# Altium project NUCLEOG431RB-Custom-IN-A2212.PrjPcb (part 3 of 4)

## Sheet Gate_Driver.SchDoc
size A2
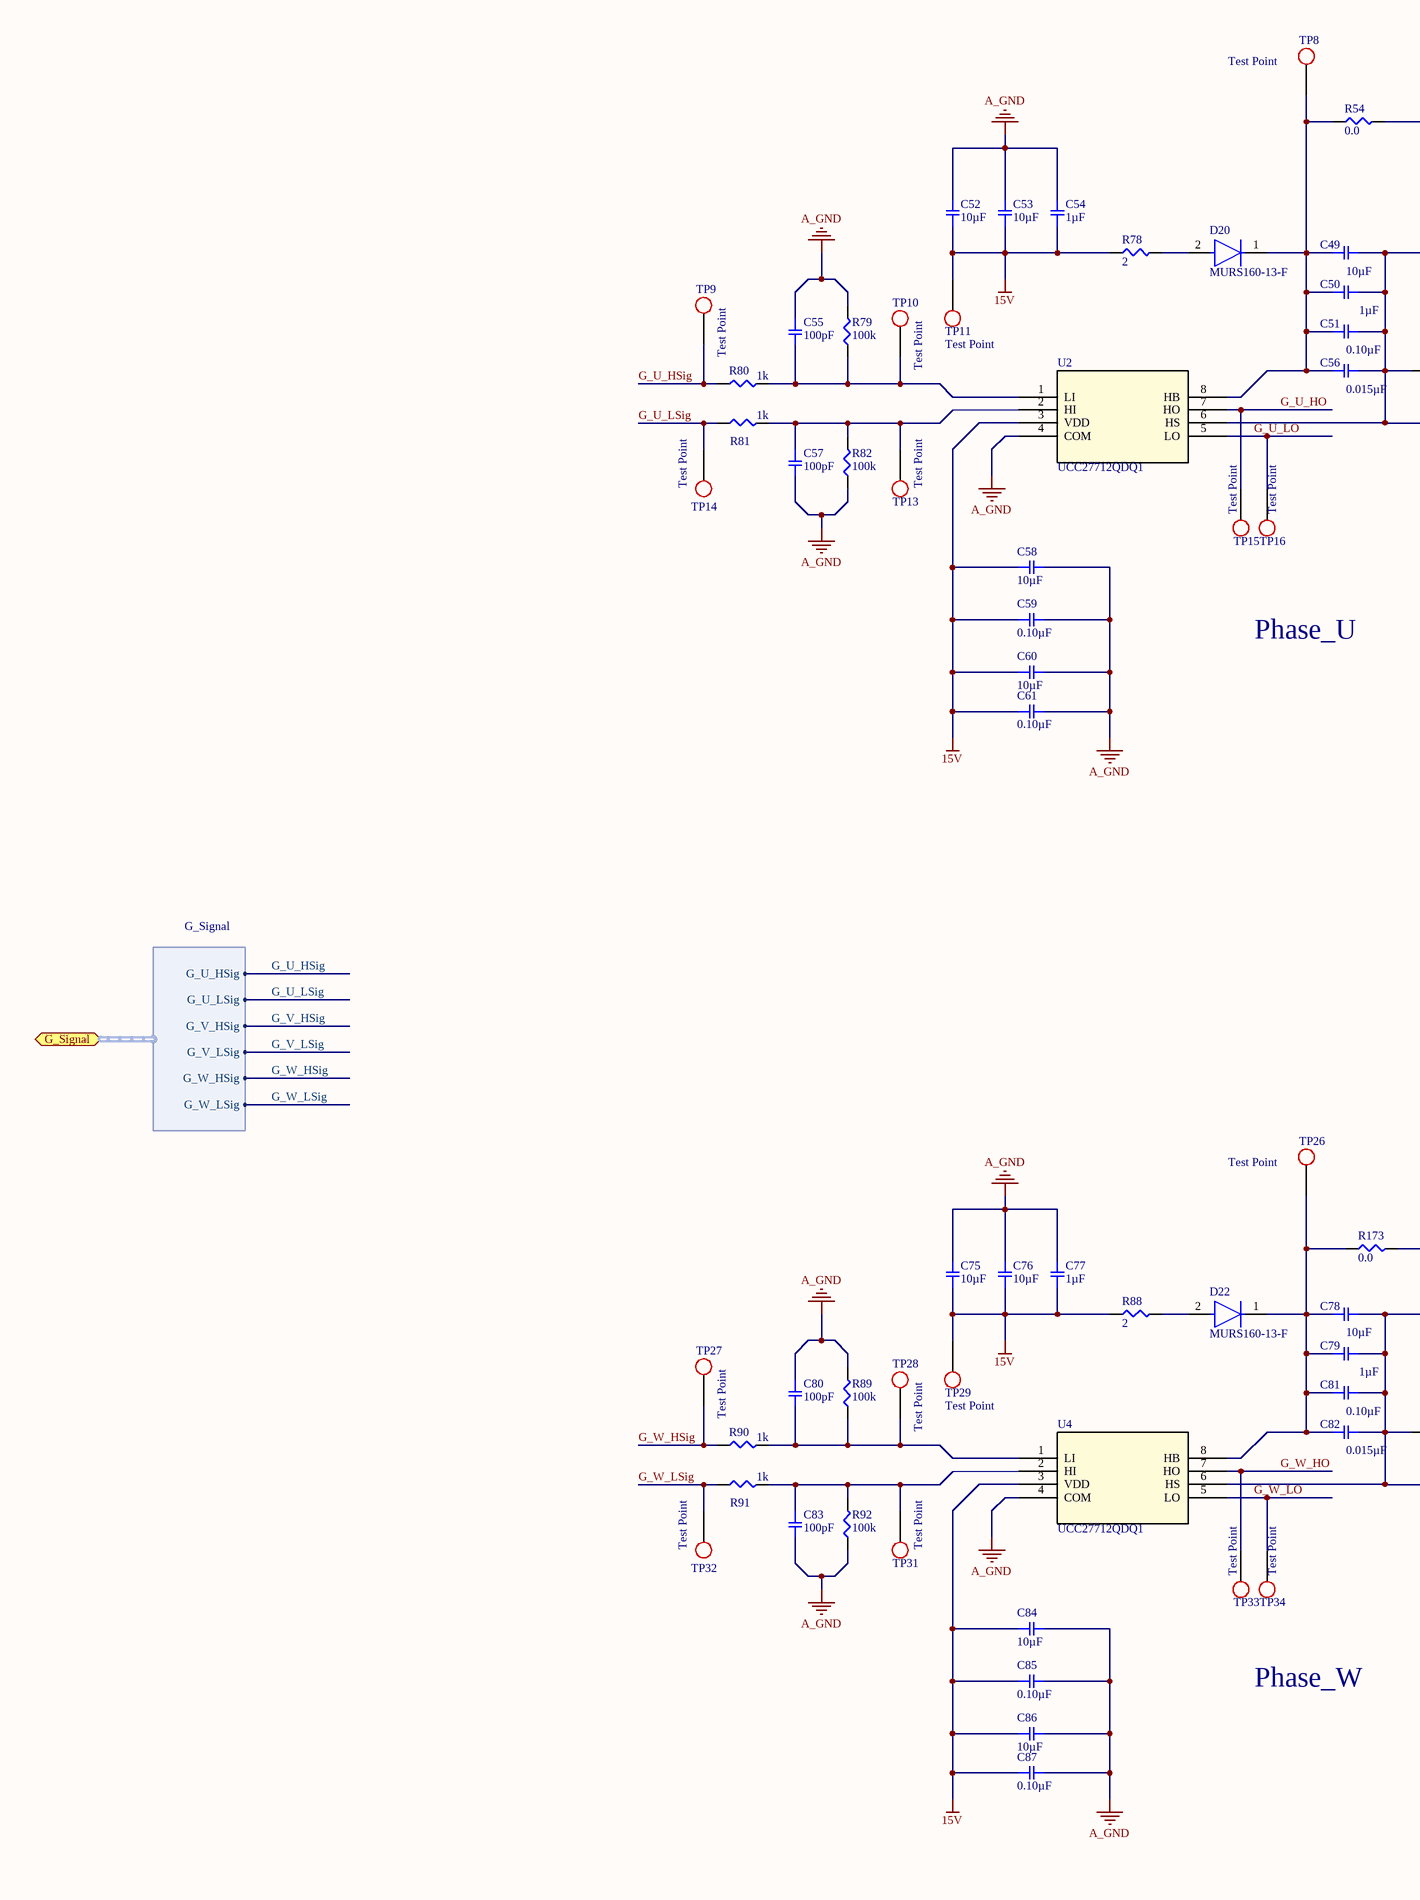
[diagram p5: Gate_Driver.SchDoc, left]
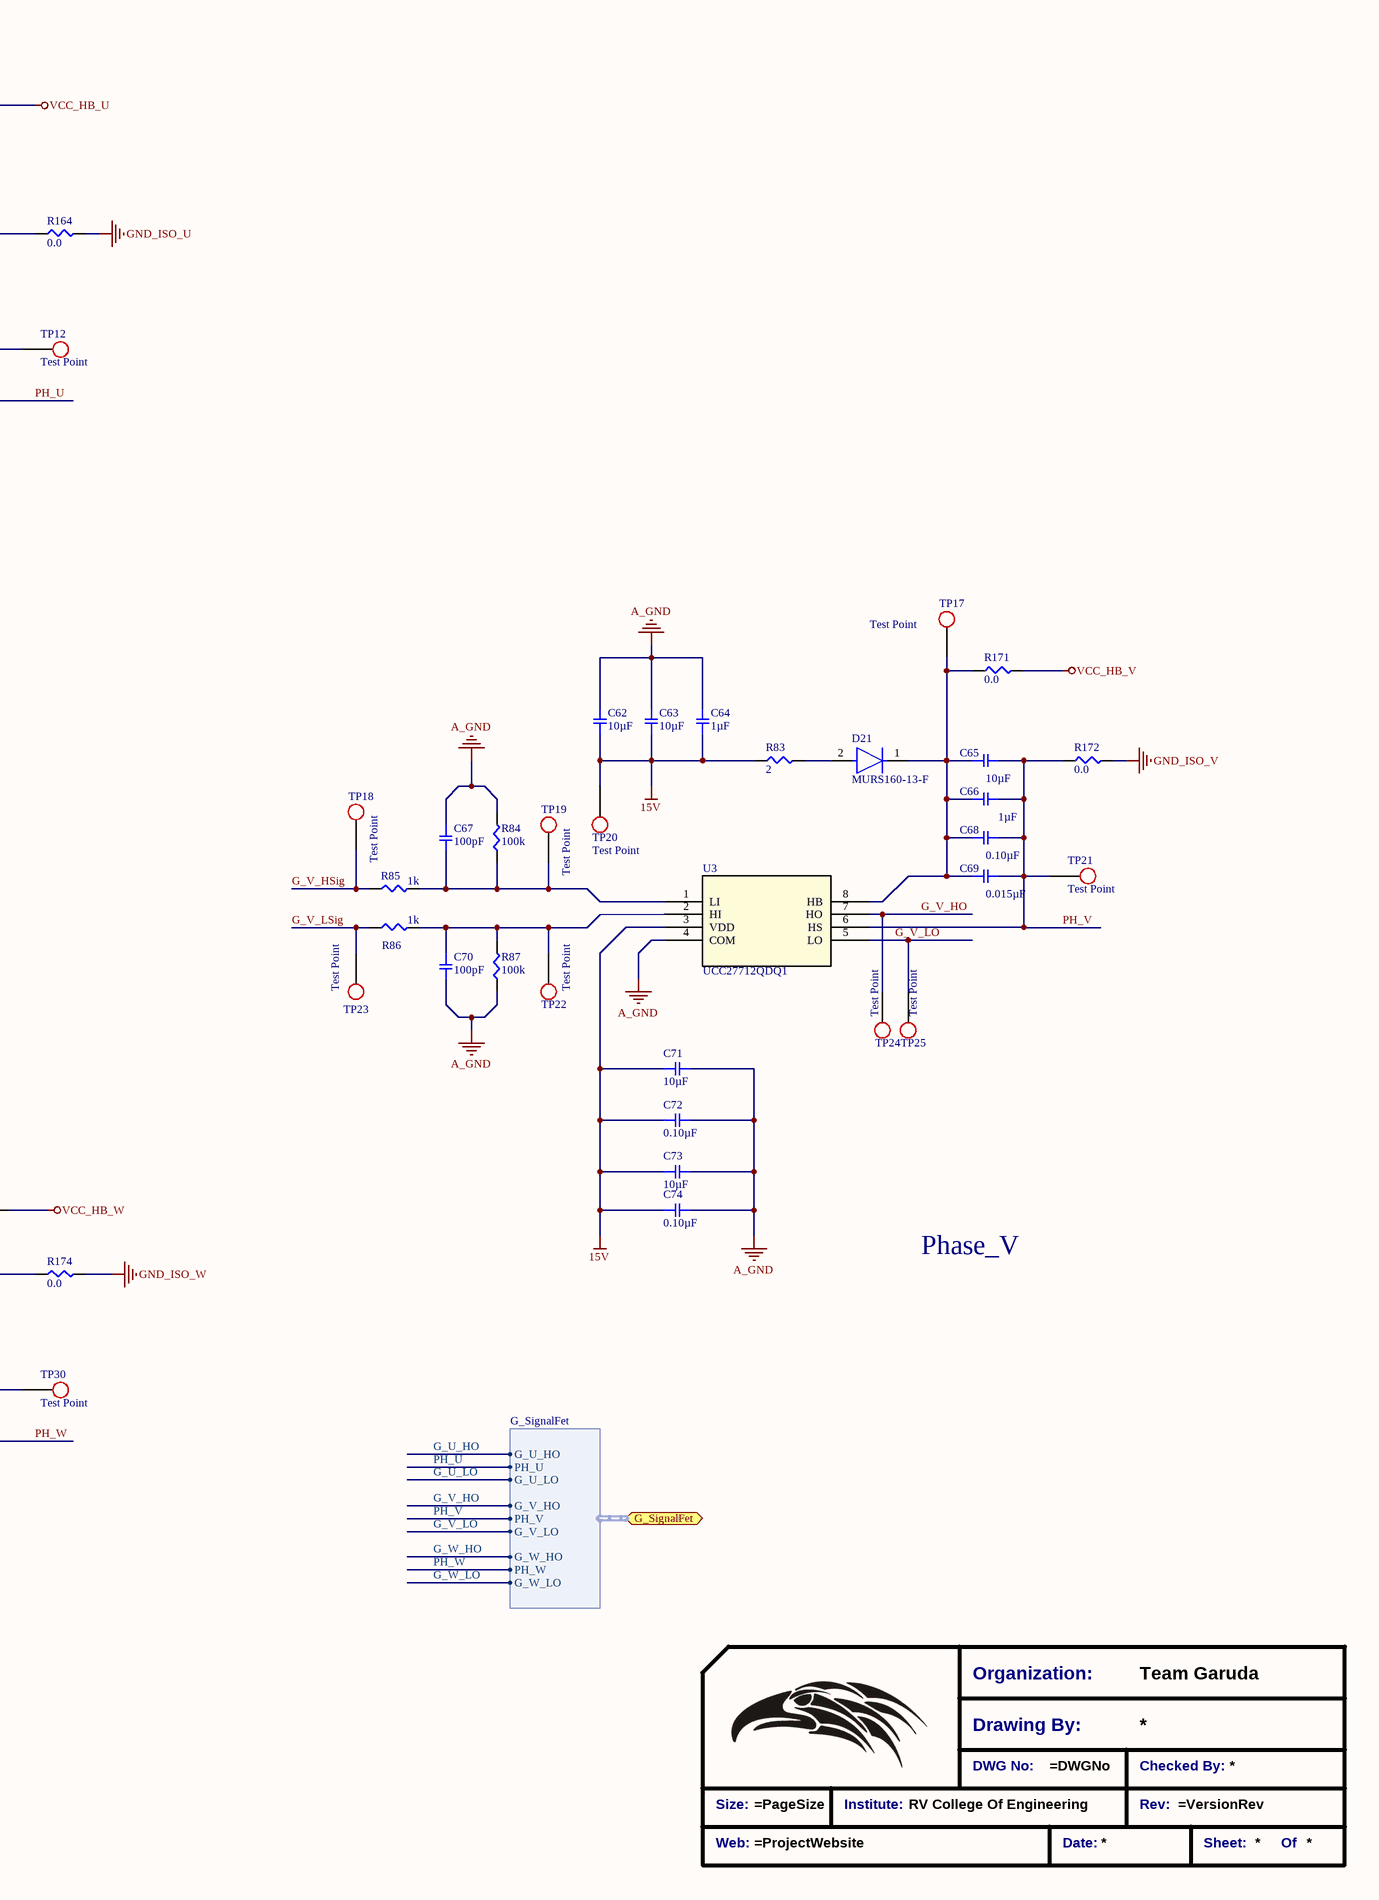
[diagram p6: Gate_Driver.SchDoc, right]

### Parts
(Parts that share a designator on the sheet are numbered #1, #2 ... from top to bottom, then left to right.)
*?#4  Title_Block  (value not drawn)  (graphical)
C49  10µF  [SMD-1206C]
C50  1µF  [SMD-0805C]
C51  0.10µF  [SMD-0805C]
C52  10µF  [SMD-1206C]
C53  10µF  [SMD-1206C]
C54  1µF  [SMD-0805C]
C55  100pF  [SMD-0805C]
C56  0.015µF  [SMD-0603C]
C57  100pF  [SMD-0805C]
C58  10µF  [SMD-1206C]
C59  0.10µF  [SMD-0805C]
C60  10µF  [SMD-1206C]
C61  0.10µF  [SMD-0805C]
C62  10µF  [SMD-1206C]
C63  10µF  [SMD-1206C]
C64  1µF  [SMD-0805C]
C65  10µF  [SMD-1206C]
C66  1µF  [SMD-0805C]
C67  100pF  [SMD-0805C]
C68  0.10µF  [SMD-0805C]
C69  0.015µF  [SMD-0603C]
C70  100pF  [SMD-0805C]
C71  10µF  [SMD-1206C]
C72  0.10µF  [SMD-0805C]
C73  10µF  [SMD-1206C]
C74  0.10µF  [SMD-0805C]
C75  10µF  [SMD-1206C]
C76  10µF  [SMD-1206C]
C77  1µF  [SMD-0805C]
C78  10µF  [SMD-1206C]
C79  1µF  [SMD-0805C]
C80  100pF  [SMD-0805C]
C81  0.10µF  [SMD-0805C]
C82  0.015µF  [SMD-0603C]
C83  100pF  [SMD-0805C]
C84  10µF  [SMD-1206C]
C85  0.10µF  [SMD-0805C]
C86  10µF  [SMD-1206C]
C87  0.10µF  [SMD-0805C]
D20  MURS160-13-F  [FP-SMB-MFG]
D21  MURS160-13-F  [FP-SMB-MFG]
D22  MURS160-13-F  [FP-SMB-MFG]
R54  0.0  [SMD-0805-RES]
R78  2  [SMD-0805-RES]
R79  100k  [SMD-0805-RES]
R80  1k  [SMD-0805-RES]
R81  1k  [SMD-0805-RES]
R82  100k  [SMD-0805-RES]
R83  2  [SMD-0805-RES]
R84  100k  [SMD-0805-RES]
R85  1k  [SMD-0805-RES]
R86  1k  [SMD-0805-RES]
R87  100k  [SMD-0805-RES]
R88  2  [SMD-0805-RES]
R89  100k  [SMD-0805-RES]
R90  1k  [SMD-0805-RES]
R91  1k  [SMD-0805-RES]
R92  100k  [SMD-0805-RES]
R164  0.0  [SMD-0805-RES]
R171  0.0  [SMD-0805-RES]
R172  0.0  [SMD-0805-RES]
R173  0.0  [SMD-0805-RES]
R174  0.0  [SMD-0805-RES]
TP8  Test Point  [Test_point_THT]  (no BOM)
TP9  Test Point  [Test_point_SMD]  (no BOM)
TP10  Test Point  [Test_point_SMD]  (no BOM)
TP11  Test Point  [Test_point_THT]  (no BOM)
TP12  Test Point  [Test_point_THT]  (no BOM)
TP13  Test Point  [Test_point_SMD]  (no BOM)
TP14  Test Point  [Test_point_SMD]  (no BOM)
TP15  Test Point  [Test_point_SMD]  (no BOM)
TP16  Test Point  [Test_point_SMD]  (no BOM)
TP17  Test Point  [Test_point_THT]  (no BOM)
TP18  Test Point  [Test_point_SMD]  (no BOM)
TP19  Test Point  [Test_point_SMD]  (no BOM)
TP20  Test Point  [Test_point_THT]  (no BOM)
TP21  Test Point  [Test_point_THT]  (no BOM)
TP22  Test Point  [Test_point_SMD]  (no BOM)
TP23  Test Point  [Test_point_SMD]  (no BOM)
TP24  Test Point  [Test_point_SMD]  (no BOM)
TP25  Test Point  [Test_point_SMD]  (no BOM)
TP26  Test Point  [Test_point_THT]  (no BOM)
TP27  Test Point  [Test_point_SMD]  (no BOM)
TP28  Test Point  [Test_point_SMD]  (no BOM)
TP29  Test Point  [Test_point_THT]  (no BOM)
TP30  Test Point  [Test_point_THT]  (no BOM)
TP31  Test Point  [Test_point_SMD]  (no BOM)
TP32  Test Point  [Test_point_SMD]  (no BOM)
TP33  Test Point  [Test_point_SMD]  (no BOM)
TP34  Test Point  [Test_point_SMD]  (no BOM)
U2  UCC27712QDQ1  [SOIC127P570X175_HS-9N]
U3  UCC27712QDQ1  [SOIC127P570X175_HS-9N]
U4  UCC27712QDQ1  [SOIC127P570X175_HS-9N]

### Ports
G_Signal (bidir, harness G_Signal), G_SignalFet (bidir, harness G_SignalFet)

### Harnesses
G_Signal: G_U_HSig, G_U_LSig, G_V_HSig, G_V_LSig, G_W_HSig, G_W_LSig
G_SignalFet: G_V_HO, PH_V, G_V_LO, PH_W, G_U_HO, PH_U, G_U_LO, G_W_HO, G_W_LO

### Nets
15V: C52.1 C53.1 C54.1 C58.1 C59.1 C60.1 C61.1 C62.1 C63.1 C64.1 C71.1 C72.1 C73.1 C74.1 C75.1 C76.1 C77.1 C84.1 C85.1 C86.1 C87.1 R78.1 R83.1 R88.1 TP11.1 TP20.1 TP29.1 U2.3(VDD) U3.3(VDD) U4.3(VDD)
A_GND: C52.2 C53.2 C54.2 C55.1 C57.2 C58.2 C59.2 C60.2 C61.2 C62.2 C63.2 C64.2 C67.1 C70.2 C71.2 C72.2 C73.2 C74.2 C75.2 C76.2 C77.2 C80.1 C83.2 C84.2 C85.2 C86.2 C87.2 R79.2 R82.1 R84.2 R87.1 R89.2 R92.1 U2.4(COM) U3.4(COM) U4.4(COM)
GND_ISO_U: R164.2
GND_ISO_V: R172.2
GND_ISO_W: R174.2
VCC_HB_U: R54.2
VCC_HB_V: R171.2
VCC_HB_W: R173.2
G_U_HO: TP15.1 U2.7(HO) ; port G_SignalFet.G_U_HO
G_U_HSig: R80.1 TP9.1 ; port G_Signal.G_U_HSig
G_U_LO: TP16.1 U2.5(LO) ; port G_SignalFet.G_U_LO
G_U_LSig: R81.1 TP14.1 ; port G_Signal.G_U_LSig
G_V_HO: TP24.1 U3.7(HO) ; port G_SignalFet.G_V_HO
G_V_HSig: R85.1 TP18.1 ; port G_Signal.G_V_HSig
G_V_LO: TP25.1 U3.5(LO) ; port G_SignalFet.G_V_LO
G_V_LSig: R86.1 TP23.1 ; port G_Signal.G_V_LSig
G_W_HO: TP33.1 U4.7(HO) ; port G_SignalFet.G_W_HO
G_W_HSig: R90.1 TP27.1 ; port G_Signal.G_W_HSig
G_W_LO: TP34.1 U4.5(LO) ; port G_SignalFet.G_W_LO
G_W_LSig: R91.1 TP32.1 ; port G_Signal.G_W_LSig
PH_U: C49.2 C50.2 C51.2 C56.2 R164.1 TP12.1 U2.6(HS) ; port G_SignalFet.PH_U
PH_V: C65.2 C66.2 C68.2 C69.2 R172.1 TP21.1 U3.6(HS) ; port G_SignalFet.PH_V
PH_W: C78.2 C79.2 C81.2 C82.2 R174.1 TP30.1 U4.6(HS) ; port G_SignalFet.PH_W
NetC49_1: C49.1 C50.1 C51.1 C56.1 D20.1(C) R54.1 TP8.1 U2.8(HB)
NetC55_2: C55.2 R79.1 R80.2 TP10.1 U2.1(LI)
NetC57_1: C57.1 R81.2 R82.2 TP13.1 U2.2(HI)
NetC65_1: C65.1 C66.1 C68.1 C69.1 D21.1(C) R171.1 TP17.1 U3.8(HB)
NetC67_2: C67.2 R84.1 R85.2 TP19.1 U3.1(LI)
NetC70_1: C70.1 R86.2 R87.2 TP22.1 U3.2(HI)
NetC78_1: C78.1 C79.1 C81.1 C82.1 D22.1(C) R173.1 TP26.1 U4.8(HB)
NetC80_2: C80.2 R89.1 R90.2 TP28.1 U4.1(LI)
NetC83_1: C83.1 R91.2 R92.2 TP31.1 U4.2(HI)
NetD20_2: D20.2(A) R78.2
NetD21_2: D21.2(A) R83.2
NetD22_2: D22.2(A) R88.2

### Notes on the sheet
- Phase_U
- Phase_V
- Phase_W
- (in symbol Title_Block) Organization:; Team Garuda; Drawing By:; DWG No:; Checked By:; Size:; Institute:; RV College Of Engineering; Rev:; Web:; Date:; Sheet:; Of

### Library data of the parts
*?#4 = Title_Block: Standard Title Block
C49 C65 C78 = GRJ31CR71E106KE11L: CAP CER 10UF 25V X7R 1206; Manufacturer: Murata Electronics North America; Factory Stock: 0; Unit Price (USD): 0.69; Minimum Quantity: 1; Tolerance: ±10%; Datasheets: http://www.murata.com/~/media/webrenewal/support/library/catalog/products/capacitor/mlcc/c02e.pdf; Image: //media.digikey.com/Renders/Murata%20Renders/GR331BD72E473KW01L.jpg; Digi-Key Part Number: 490-10940-1-ND; Part Number: GRJ31CR71E106KE11L; Quantity Available: 1598; @ qty: 0; Packaging: Cut Tape (CT); Series: GRJ; Part Status: Active; Value: 10µF; Voltage: 25V; Temperature Coefficient: X7R; Operating Temperature: -55°C ~ 125°C; Features: Soft Termination; Ratings: -; Applications: Boardflex Sensitive; Mounting Type: Surface Mount, MLCC; Package / Case: 1206 (3216 Metric); Size / Dimension: 0.126" L x 0.063" W (3.20mm x 1.60mm); Height - Seated (Max): -; Thickness (Max): 0.075" (1.90mm); Lead Spacing: -; Lead Style: -
C50 C66 C79 = GCJ21BR71H105KA01L: CAP CER 1UF 50V X7R 0805; Manufacturer: Murata Electronics North America; Factory Stock: 0; Unit Price (USD): 0.33; Minimum Quantity: 1; Tolerance: ±10%; Datasheets: http://www.murata.com/~/media/webrenewal/support/library/catalog/products/capacitor/mlcc/c03e.ashx; Image: //media.digikey.com/Renders/Murata%20Renders/0805%20(2012%20Metric)%20.85mm.jpg; Digi-Key Part Number: 490-10667-1-ND; Part Number: GCJ21BR71H105KA01L; Quantity Available: 55137; @ qty: 0; Packaging: Cut Tape (CT); Series: GCJ; Part Status: Active; Value: 1µF; Voltage: 50V; Temperature Coefficient: X7R; Operating Temperature: -55°C ~ 125°C; Features: Soft Termination; Ratings: AEC-Q200; Applications: Automotive, Boardflex Sensitive; Mounting Type: Surface Mount, MLCC; Package / Case: 0805 (2012 Metric); Size / Dimension: 0.079" L x 0.049" W (2.00mm x 1.25mm); Height - Seated (Max): -; Thickness (Max): 0.057" (1.45mm); Lead Spacing: -; Lead Style: -
C51 C68 C81 = GRJ21BR71H104KE01L: CAP CER 0.1UF 50V X7R 0805; Manufacturer: Murata Electronics North America; Factory Stock: 0; Unit Price (USD): 0.19; Minimum Quantity: 1; Tolerance: ±10%; Datasheets: http://www.murata.com/~/media/webrenewal/support/library/catalog/products/capacitor/mlcc/c02e.pdf; Image: //media.digikey.com/Renders/Murata%20Renders/0805%20(2012%20Metric)%20.85mm.jpg; Digi-Key Part Number: 490-10923-1-ND; Part Number: GRJ21BR71H104KE01L; Quantity Available: 3070; @ qty: 0; Packaging: Cut Tape (CT); Series: GRJ; Part Status: Active; Value: 0.10µF; Voltage: 50V; Temperature Coefficient: X7R; Operating Temperature: -55°C ~ 125°C; Features: Soft Termination; Ratings: -; Applications: Boardflex Sensitive; Mounting Type: Surface Mount, MLCC; Package / Case: 0805 (2012 Metric); Size / Dimension: 0.079" L x 0.049" W (2.00mm x 1.25mm); Height - Seated (Max): -; Thickness (Max): 0.057" (1.45mm); Lead Spacing: -; Lead Style: -
C52 C53 C58 C60 C62 C63 C71 C73 C75 C76 C84 C86 = GRM31CR61H106KA12L: CAP CER 10UF 50V X5R 1206; Manufacturer: Murata Electronics North America; Factory Stock: 0; Unit Price (USD): 0.65; Minimum Quantity: 1; Tolerance: ±10%; Datasheets: http://www.murata.com/~/media/webrenewal/support/library/catalog/products/capacitor/mlcc/c02e.pdf; Image: //media.digikey.com/Renders/Murata%20Renders/GR331BD72E473KW01L.jpg; Digi-Key Part Number: 490-5961-1-ND; Part Number: GRM31CR61H106KA12L; Quantity Available: 86736; @ qty: 0; Packaging: Cut Tape (CT); Series: GRM; Part Status: Active; Value: 10µF; Voltage: 50V; Temperature Coefficient: X5R; Operating Temperature: -55°C ~ 85°C; Features: -; Ratings: -; Applications: General Purpose; Mounting Type: Surface Mount, MLCC; Package / Case: 1206 (3216 Metric); Size / Dimension: 0.126" L x 0.063" W (3.20mm x 1.60mm); Height - Seated (Max): -; Thickness (Max): 0.071" (1.80mm); Lead Spacing: -; Lead Style: -
C54 C64 C77 = GCJ219R71C105KA01D: CAP CER 1UF 16V X7R 0805; Manufacturer: Murata Electronics North America; Factory Stock: 0; Unit Price (USD): 0.29; Minimum Quantity: 1; Tolerance: ±10%; Datasheets: http://www.murata.com/~/media/webrenewal/support/library/catalog/products/capacitor/mlcc/c03e.ashx; Image: //media.digikey.com/Renders/Murata%20Renders/0805%20(2012%20Metric)%20.85mm.jpg; Digi-Key Part Number: 490-5800-1-ND; Part Number: GCJ219R71C105KA01D; Quantity Available: 140338; @ qty: 0; Packaging: Cut Tape (CT); Series: GCJ; Part Status: Active; Value: 1µF; Voltage: 16V; Temperature Coefficient: X7R; Operating Temperature: -55°C ~ 125°C; Features: Soft Termination; Ratings: AEC-Q200; Applications: Automotive, Boardflex Sensitive; Mounting Type: Surface Mount, MLCC; Package / Case: 0805 (2012 Metric); Size / Dimension: 0.079" L x 0.049" W (2.00mm x 1.25mm); Height - Seated (Max): -; Thickness (Max): 0.037" (0.95mm); Lead Spacing: -; Lead Style: -
C55 C57 C67 C70 C80 C83 = GCM2165C1H101JA16D: CAP CER 100PF 50V NP0 0805; Manufacturer: Murata Electronics North America; Factory Stock: 0; Unit Price (USD): 0.13; Minimum Quantity: 1; Tolerance: ±5%; Temperature Coefficient: C0G, NP0; Datasheets: http://www.murata.com/~/media/webrenewal/support/library/catalog/products/capacitor/mlcc/c03e.ashx; Image: //media.digikey.com/Renders/Murata%20Renders/0805%28GxM6%29.jpg; Digi-Key Part Number: 490-8031-1-ND; Part Number: GCM2165C1H101JA16D; Quantity Available: 42017; @ qty: 0; Packaging: Cut Tape (CT); Series: GCM; Part Status: Active; Value: 100pF; Voltage: 50V; Operating Temperature: -55°C ~ 125°C; Features: -; Ratings: AEC-Q200; Applications: Automotive; Mounting Type: Surface Mount, MLCC; Package / Case: 0805 (2012 Metric); Size / Dimension: 0.079" L x 0.049" W (2.00mm x 1.25mm); Height - Seated (Max): -; Thickness (Max): 0.028" (0.70mm); Lead Spacing: -; Lead Style: -
C56 C69 C82 = GCJ188R72A153KA01D: CAP CER 0.015UF 100V X7R 0603; Manufacturer: Murata Electronics North America; Factory Stock: 0; Unit Price (USD): 0.26; Minimum Quantity: 1; Tolerance: ±10%; Datasheets: http://www.murata.com/~/media/webrenewal/support/library/catalog/products/capacitor/mlcc/c03e.ashx; Image: //media.digikey.com/Renders/Murata%20Renders/0603%28LQG18%29.jpg; Digi-Key Part Number: 490-5770-1-ND; Part Number: GCJ188R72A153KA01D; Quantity Available: 450; @ qty: 0; Packaging: Cut Tape (CT); Series: GCJ; Part Status: Active; Value: 0.015µF; Voltage: 100V; Temperature Coefficient: X7R; Operating Temperature: -55°C ~ 125°C; Features: Soft Termination; Ratings: AEC-Q200; Applications: Automotive, Boardflex Sensitive; Mounting Type: Surface Mount, MLCC; Package / Case: 0603 (1608 Metric); Size / Dimension: 0.063" L x 0.031" W (1.60mm x 0.80mm); Height - Seated (Max): -; Thickness (Max): 0.031" (0.80mm); Lead Spacing: -; Lead Style: -
C59 C61 C72 C74 C85 C87 = GCM21BR71H104KA37K: CAP CER 0.1UF 50V X7R 0805; Manufacturer: Murata Electronics North America; Factory Stock: 0; Unit Price (USD): 0.12; Minimum Quantity: 1; Tolerance: ±10%; Datasheets: http://www.murata.com/~/media/webrenewal/support/library/catalog/products/capacitor/mlcc/c03e.ashx; Image: //media.digikey.com/photos/Murata%20Photos/NCP,GCM%20SERIES%200805.jpg; Digi-Key Part Number: 490-8049-1-ND; Part Number: GCM21BR71H104KA37K; Quantity Available: 322; @ qty: 0; Packaging: Cut Tape (CT); Series: GCM; Part Status: Active; Value: 0.10µF; Voltage: 50V; Temperature Coefficient: X7R; Operating Temperature: -55°C ~ 125°C; Features: -; Ratings: AEC-Q200; Applications: Automotive; Mounting Type: Surface Mount, MLCC; Package / Case: 0805 (2012 Metric); Size / Dimension: 0.079" L x 0.049" W (2.00mm x 1.25mm); Height - Seated (Max): -; Thickness (Max): 0.055" (1.40mm); Lead Spacing: -; Lead Style: -
D20-D22 = CMP-12791-000032-1: DIODE GEN PURP 600V 1A SMB; Manufacturer: Diodes Inc.; Standoff Height: 0.05mm; Max Surge Forward Current: 35A; Capacitance: 10pF; Peak Reverse Current: 5uA; Max Junction Temp: +150°C; Value: 10pF; Reverse Voltage: 600V; Device Class L1: Discrete Semiconductors; Lead Free: Yes; Temperature Range Low: -55°C; Mouser Description: Rectifier Super-Fast Recovery Gpp Smb 1.0A 600V Rohs 3K Rohs Compliant: Yes; Temperature: -55°C to +150°C; Category: Diode; Digikey Description: DIODE GEN PURP 600V 1A SMB; Height: 2.5mm; Manufacturer Part Number: MURS160-13-F; RoHS: TRUE; ComponentLink2Description: Datasheet; Octopart: https://octopart.com/murs160-13-f-diodes+inc.-332437; ComponentLink2URL: https://www.diodes.com/assets/Datasheets/ds30130.pdf; Automotive: No; Max Repetitive Reverse Voltage: 600V; Footprint Url: https://www.diodes.com/assets/Package-Files/SMB.pdf; Device Class L3: Rectifier Diodes; Temperature Range High: +150°C; Device Class L2: Diodes; Package: SMB; Forward Current: 1A
R54 R164 R171-R174 = ERJ-6GEY0R00V: RES SMD 0.0 OHM JUMPER 1/8W 0805; Manufacturer: Panasonic Electronic Components; Factory Stock: 0; Unit Price (USD): 0.00544; @ qty: 1500; Minimum Quantity: 1; Power (Watts): 0.125W, 1/8W; Part Number: ERJ-6GEY0R00V; Datasheets: http://industrial.panasonic.com/www-cgi/jvcr13pz.cgi?E+PZ+3+AOA0001+ERJ6GEY0R00V+7+WW; Image: //media.digikey.com/Renders/Panasonic%20Renders/ERJ-0805%20Pkg.jpg; Digi-Key Part Number: P0.0ACT-ND; Quantity Available: 1597627; Packaging: Cut Tape (CT); Series: ERJ; Part Status: Active; Value: 0.0; Tolerance: Jumper; Composition: Thick Film; Features: Automotive AEC-Q200; Temperature Coefficient: -; Operating Temperature: -55°C ~ 155°C; Package / Case: 0805 (2012 Metric); Supplier Device Package: 0805; Size / Dimension: 0.079" L x 0.049" W (2.00mm x 1.25mm); Height - Seated (Max): 0.028" (0.70mm); Number of Terminations: 2; Failure Rate: -
R78 R83 R88 = ERJ-6BQF2R0V: RES SMD 2 OHM 1% 1/3W 0805; Manufacturer: Panasonic Electronic Components; Factory Stock: 0; Unit Price (USD): 0.05834; @ qty: 1500; Minimum Quantity: 1; Power (Watts): 0.333W, 1/3W; Temperature Coefficient: ±200ppm/°C; Part Number: ERJ-6BQF2R0V; Datasheets: https://industrial.panasonic.com/cdbs/www-data/pdf/RDA0000/AOA0000C239.pdf; Image: //media.digikey.com/Renders/Panasonic%20Renders/ERJ-0805%20Pkg.jpg; Digi-Key Part Number: P17503CT-ND; Quantity Available: 4729; Packaging: Cut Tape (CT); Series: ERJ; Part Status: Active; Value: 2; Tolerance: ±1%; Composition: Thick Film; Features: Automotive AEC-Q200, Current Sense; Operating Temperature: -55°C ~ 125°C; Package / Case: 0805 (2012 Metric); Supplier Device Package: 0805; Size / Dimension: 0.079" L x 0.049" W (2.00mm x 1.25mm); Height - Seated (Max): 0.028" (0.70mm); Number of Terminations: 2; Failure Rate: -
R79 R82 R84 R87 R89 R92 = ERJ-6ENF1003V: RES SMD 100K OHM 1% 1/8W 0805; Manufacturer: Panasonic Electronic Components; Factory Stock: 0; Unit Price (USD): 0.00729; @ qty: 1500; Minimum Quantity: 1; Power (Watts): 0.125W, 1/8W; Temperature Coefficient: ±100ppm/°C; Part Number: ERJ-6ENF1003V; Datasheets: http://industrial.panasonic.com/www-cgi/jvcr13pz.cgi?E+PZ+3+AOA0002+ERJ6ENF1003V+7+WW; Image: //media.digikey.com/Renders/Panasonic%20Renders/ERJ-0805%20Pkg.jpg; Digi-Key Part Number: P100KCCT-ND; Quantity Available: 760677; Packaging: Cut Tape (CT); Series: ERJ; Part Status: Active; Value: 100k; Tolerance: ±1%; Composition: Thick Film; Features: Automotive AEC-Q200; Operating Temperature: -55°C ~ 155°C; Package / Case: 0805 (2012 Metric); Supplier Device Package: 0805; Size / Dimension: 0.079" L x 0.049" W (2.00mm x 1.25mm); Height - Seated (Max): 0.028" (0.70mm); Number of Terminations: 2; Failure Rate: -
R80 R81 R85 R86 R90 R91 = ERJ-6GEYJ102V: RES SMD 1K OHM 5% 1/8W 0805; Manufacturer: Panasonic Electronic Components; Factory Stock: 0; Unit Price (USD): 0.00496; @ qty: 1500; Minimum Quantity: 1; Power (Watts): 0.125W, 1/8W; Temperature Coefficient: ±200ppm/°C; Part Number: ERJ-6GEYJ102V; Datasheets: http://industrial.panasonic.com/www-cgi/jvcr13pz.cgi?E+PZ+3+AOA0001+ERJ6GEYJ102V+7+WW; Image: //media.digikey.com/Renders/Panasonic%20Renders/ERJ-0805%20Pkg.jpg; Digi-Key Part Number: P1.0KACT-ND; Quantity Available: 1082417; Packaging: Cut Tape (CT); Series: ERJ; Part Status: Active; Value: 1k; Tolerance: ±5%; Composition: Thick Film; Features: Automotive AEC-Q200; Operating Temperature: -55°C ~ 155°C; Package / Case: 0805 (2012 Metric); Supplier Device Package: 0805; Size / Dimension: 0.079" L x 0.049" W (2.00mm x 1.25mm); Height - Seated (Max): 0.028" (0.70mm); Number of Terminations: 2; Failure Rate: -
U2-U4 = UCC27712QDQ1: No Description Available; Vendor: Texas Instruments; Built_By: EMA_Molly; SourceLibrary: TI_2019-05-11; Manufacturer_Part_Number: UCC27712QDQ1; Copyright: Copyright (C) 2018 Accelerated Designs. All rights reserved; RefDes: RefDes; Type: DEV

## Sheet Analog_Sense.SchDoc
size A3
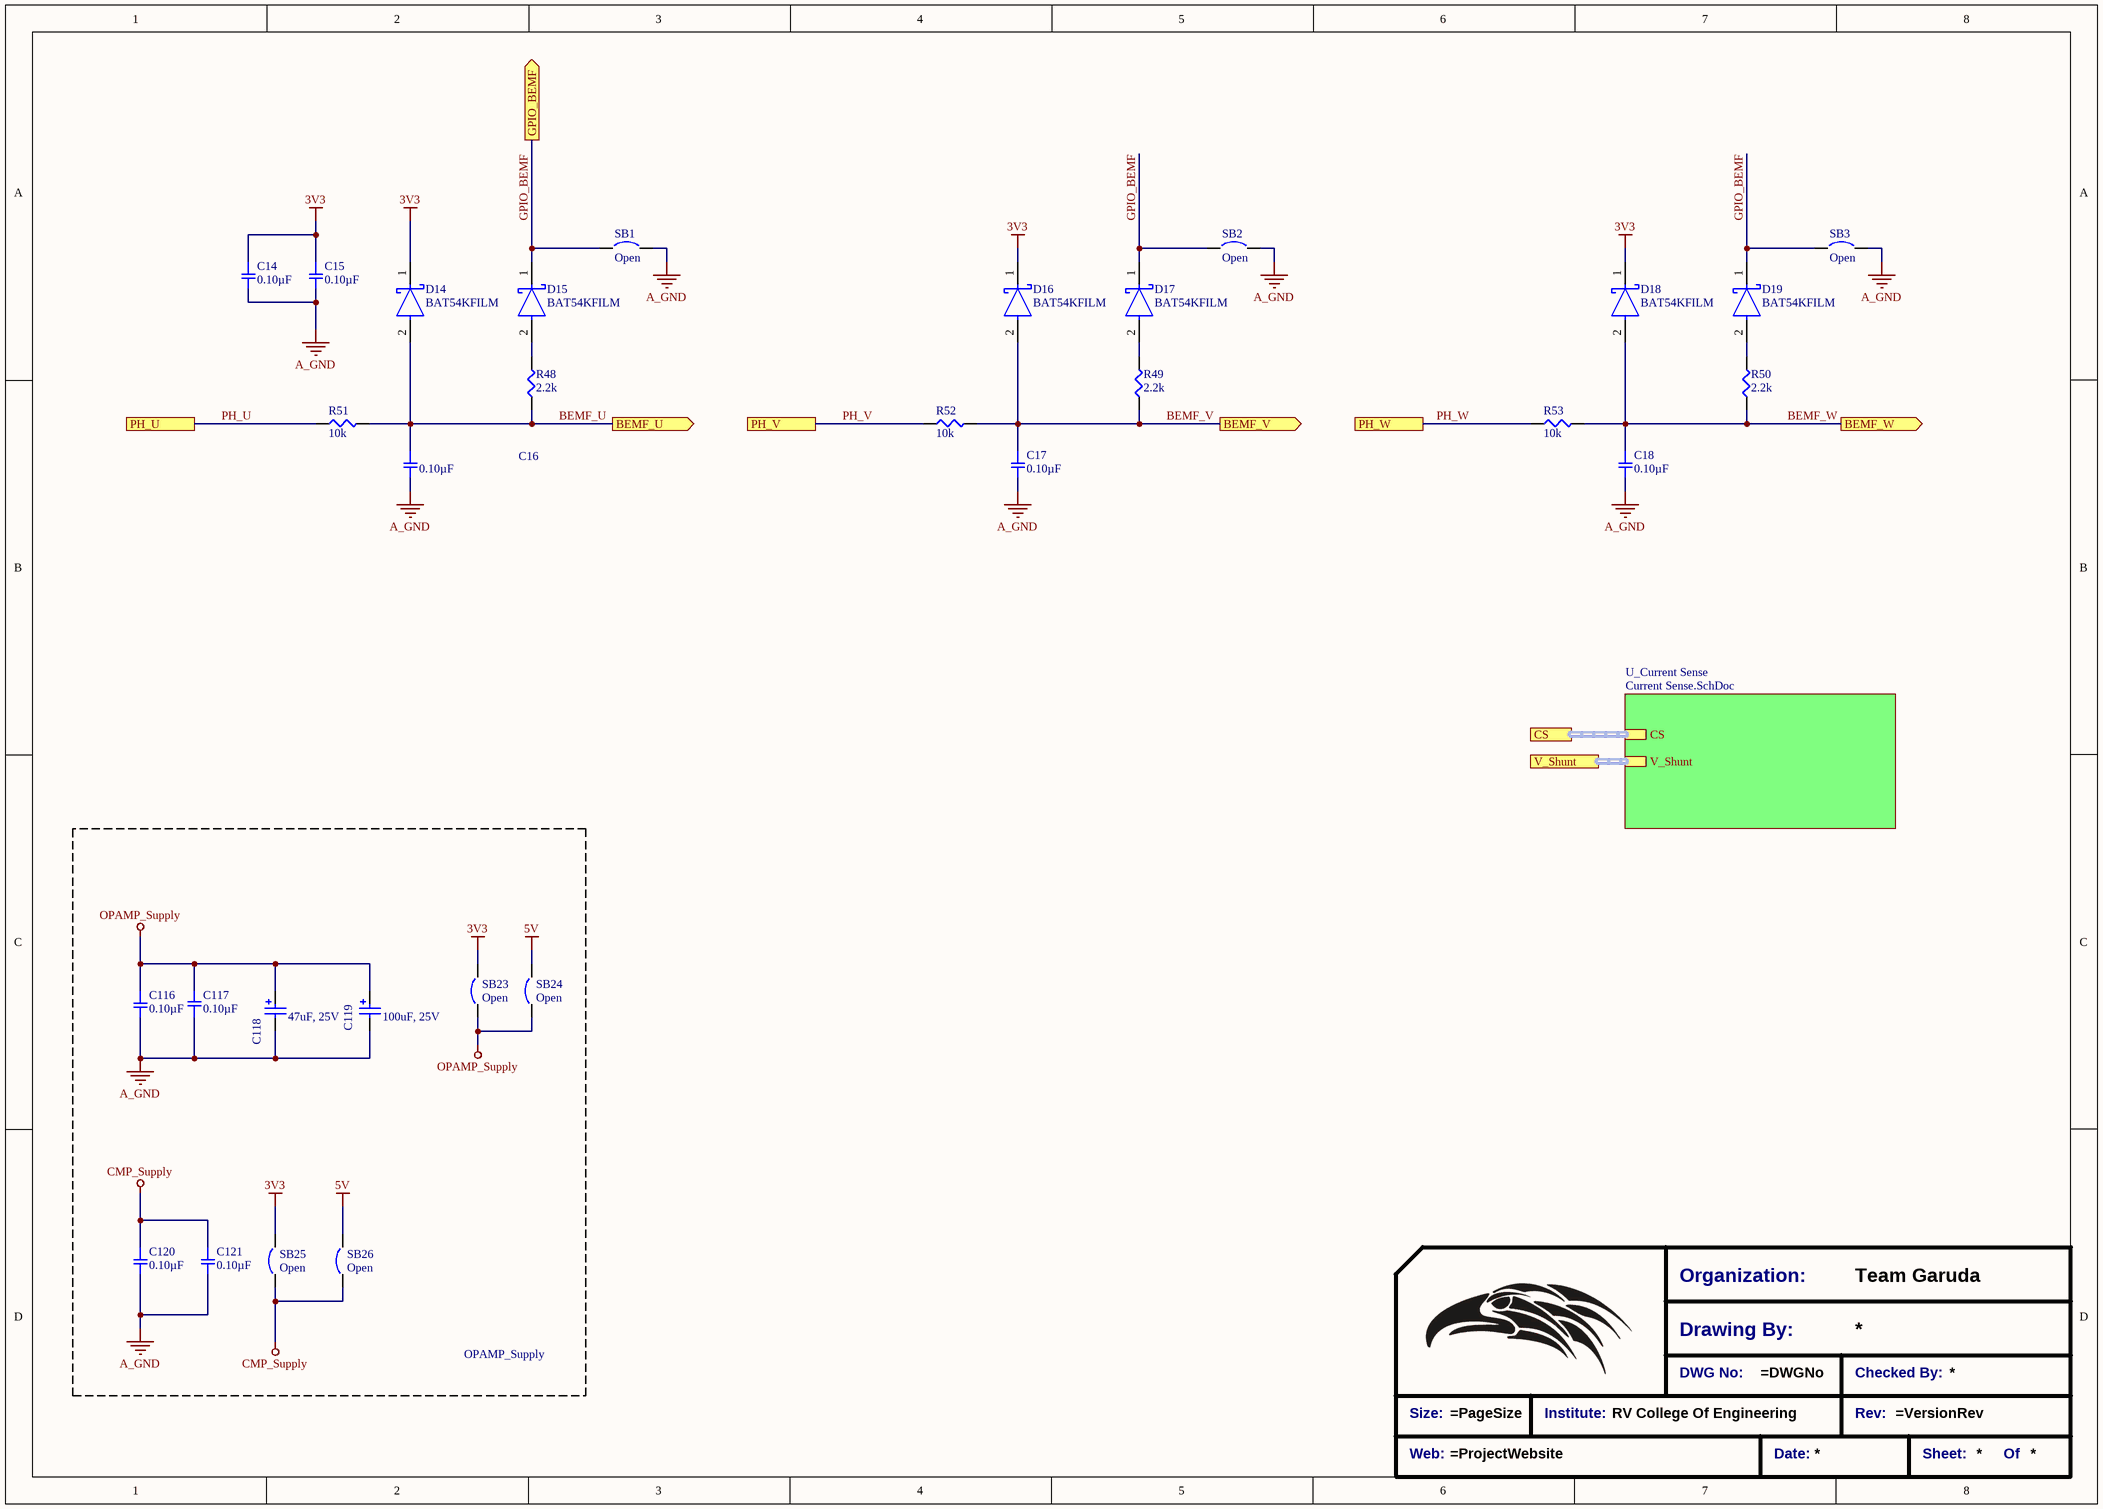
[diagram p7: Analog_Sense.SchDoc]

### Parts
(Parts that share a designator on the sheet are numbered #1, #2 ... from top to bottom, then left to right.)
*?#5  Title_Block  (value not drawn)  (graphical)
C14  0.10µF  [SMD-0805C]
C15  0.10µF  [SMD-0805C]
C16  0.10µF  [SMD-0805C]
C17  0.10µF  [SMD-0805C]
C18  0.10µF  [SMD-0805C]
C116  0.10µF  [SMD-0805C]
C117  0.10µF  [SMD-0603C]
C118  47uF, 25V  [WCAP-ASLL_6.3x5.5]
C119  100uF, 25V  [WCAP-ASLU_8x6.5]
C120  0.10µF  [SMD-0805C]
C121  0.10µF  [SMD-0805C]
D14  BAT54KFILM  [FP-SOD-523-MFG]
D15  BAT54KFILM  [FP-SOD-523-MFG]
D16  BAT54KFILM  [FP-SOD-523-MFG]
D17  BAT54KFILM  [FP-SOD-523-MFG]
D18  BAT54KFILM  [FP-SOD-523-MFG]
D19  BAT54KFILM  [FP-SOD-523-MFG]
R48  2.2k  [SMD-1206-RES]
R49  2.2k  [SMD-1206-RES]
R50  2.2k  [SMD-1206-RES]
R51  10k  [SMD-0805-RES]
R52  10k  [SMD-0805-RES]
R53  10k  [SMD-0805-RES]
SB1  Open  [SB_0603]  (no BOM)
SB2  Open  [SB_0603]  (no BOM)
SB3  Open  [SB_0603]  (no BOM)
SB23  Open  [Solder Bridge - HP]  (no BOM)
SB24  Open  [Solder Bridge - HP]  (no BOM)
SB25  Open  [Solder Bridge - HP - SQ]  (no BOM)
SB26  Open  [Solder Bridge - HP - SQ]  (no BOM)

### Blocks framed on the sheet
OPAMP_Supply: C116-C121 SB23-SB26

### Sub-sheets
U_Current Sense = Current Sense.SchDoc: CS (harness CS), V_Shunt (harness V_Shunt)

### Ports
BEMF_U (out), BEMF_V (out), BEMF_W (out), CS (harness CS), GPIO_BEMF (out), PH_U, PH_V, PH_W, V_Shunt (harness V_Shunt)

### Nets
3v3: C14.1 C15.1 D14.1(C) D16.1(C) D18.1(C) SB23.2 SB25.2
5V: SB24.2 SB26.2
A_GND: C14.2 C15.2 C16.2 C17.2 C18.2 C116.2 C117.1 C118.1(N) C119.1(N) C120.2 C121.2 SB1.2 SB2.2 SB3.2
CMP_Supply: C120.1 C121.1 SB25.1 SB26.1
OPAMP_Supply: C116.1 C117.2 C118.2(P) C119.2(P) SB23.1 SB24.1
BEMF_U: C16.1 D14.2(A) R48.1 R51.2 ; port BEMF_U
BEMF_V: C17.1 D16.2(A) R49.1 R52.2 ; port BEMF_V
BEMF_W: C18.1 D18.2(A) R50.1 R53.2 ; port BEMF_W
GPIO_BEMF: D15.1(C) D17.1(C) D19.1(C) SB1.1 SB2.1 SB3.1 ; port GPIO_BEMF
PH_U: R51.1 ; port PH_U
PH_V: R52.1 ; port PH_V
PH_W: R53.1 ; port PH_W
NetD15_2: D15.2(A) R48.2
NetD17_2: D17.2(A) R49.2
NetD19_2: D19.2(A) R50.2

### Buses and harness runs
harness port CS = sheet U_Current Sense/CS
harness port V_Shunt = sheet U_Current Sense/V_Shunt

### Notes on the sheet
- (in symbol Title_Block) Organization:; Team Garuda; Drawing By:; DWG No:; Checked By:; Size:; Institute:; RV College Of Engineering; Rev:; Web:; Date:; Sheet:; Of

### Library data of the parts
*?#5 = Title_Block: Standard Title Block
C14-C18 C116 C120 C121 = GCD21BR71H104KA01L: CAP CER 0.1UF 50V X7R 0805; Manufacturer: Murata Electronics North America; Factory Stock: 0; Unit Price (USD): 0.24; Minimum Quantity: 1; Tolerance: ±10%; Datasheets: http://www.murata.com/~/media/webrenewal/support/library/catalog/products/capacitor/mlcc/c03e.ashx; Image: //media.digikey.com/Renders/Murata%20Renders/0805%28GxM6%29.jpg; Digi-Key Part Number: 490-11955-1-ND; Part Number: GCD21BR71H104KA01L; Quantity Available: 157; @ qty: 0; Packaging: Cut Tape (CT); Series: GCD; Part Status: Active; Value: 0.10µF; Voltage: 50V; Temperature Coefficient: X7R; Operating Temperature: -55°C ~ 125°C; Features: -; Ratings: AEC-Q200; Applications: Automotive; Mounting Type: Surface Mount, MLCC; Package / Case: 0805 (2012 Metric); Size / Dimension: 0.079" L x 0.049" W (2.00mm x 1.25mm); Height - Seated (Max): -; Thickness (Max): 0.049" (1.25mm); Lead Spacing: -; Lead Style: -
C117 = GCM188R71C104KA37D: CAP CER 0.1UF 16V X7R 0603; Manufacturer: Murata Electronics North America; Factory Stock: 0; Unit Price (USD): 0.18; Minimum Quantity: 1; Tolerance: ±10%; Datasheets: http://www.murata.com/~/media/webrenewal/support/library/catalog/products/capacitor/mlcc/c03e.ashx; Image: //media.digikey.com/Renders/Murata%20Renders/0603%28GCM188%29.jpg; Digi-Key Part Number: 490-4774-1-ND; Part Number: GCM188R71C104KA37D; Quantity Available: 284085; @ qty: 0; Packaging: Cut Tape (CT); Series: GCM; Part Status: Active; Value: 0.10µF; Voltage: 16V; Temperature Coefficient: X7R; Operating Temperature: -55°C ~ 125°C; Features: -; Ratings: AEC-Q200; Applications: Automotive; Mounting Type: Surface Mount, MLCC; Package / Case: 0603 (1608 Metric); Size / Dimension: 0.063" L x 0.031" W (1.60mm x 0.80mm); Height - Seated (Max): -; Thickness (Max): 0.035" (0.90mm); Lead Spacing: -; Lead Style: -
C118 = 865060443004: WCAP-ASLL SMT Aluminum Electrolytic Capacitors, D6.3mm x L5.5mm, 47uF, +/-20%, 25VDC; Dissipation Factor: 14%; Endurance: 2000h; Leakage Current: 11.75uA; Ripple Current max.: 230mA; Technical Reference: ASED055470M025DVCTBB000; ComponentLink1Description: Manufacturer; ComponentLink1URL: http://www.we-online.de; ComponentLink2Description: Datasheet; ComponentLink2URL: https://katalog.we-online.com/pbs/datasheet/865060443004.pdf; Length: 5.5mm; Mounting Technology: SMT; Operating Temperature: -55 to +105degC; Packaging: Tape and Reel; Published Date: August 2019; Capacitance: 47uF; Diameter: 6.3mm; Part Number: 865060443004; Publisher: Wurth Elektronik; Capacitance Tolerance: +/-20%; Rated Voltage: 25VDC
C119 = 865090449009: WCAP-ASLU Aluminium Electrolytic Capacitors, D8mm x L6.5mm, 100uF, +/-20%, 25VDC; Dissipation Factor: 16%; Leakage Current: 5uA; Endurance: 1000h; Technical Reference: ASBE065101M025DVCTBA000; Ripple Current max.: 110mA; ComponentLink1Description: Manufacturer; ComponentLink1URL: http://www.we-online.de; ComponentLink2Description: Datasheet; ComponentLink2URL: https://katalog.we-online.com/pbs/datasheet/865090449009.pdf; Mounting Technology: SMD; Operating Temperature: -40 to +85degC; Packaging: Tape and Reel; Part Number: 865090449009; Publisher: Wurth Elektronik; Capacitance: 100uF; Diameter: 8mm; Length: 6.5mm; Published Date: August 2019; Rated Voltage: 25VDC; Capacitance Tolerance: +/-20%
D14-D19 = CMP-12187-000026-1: DIODE SCHOTTKY 40V 300MA SOD523; Manufacturer: STMicroelectronics; Capacitance: 7pF; Value: 7pF; Max Surge Forward Current: 1.25A; Peak Reverse Current: 1uA; Max Junction Temp: +150°C; Device Class L2: Diodes; Temperature Range Low: -40°C; Category: Diode; Manufacturer Part Number: BAT54KFILM; Digikey Description: DIODE SCHOTTKY 40V 300MA SOD523; Device Class L3: Schottky Diodes; Automotive: No; Height: 0.7mm; Octopart: https://octopart.com/bat54kfilm-stmicroelectronics-39618022; ComponentLink2Description: Datasheet; Temperature Range High: +150°C; Device Class L1: Discrete Semiconductors; Max Repetitive Reverse Voltage: 40V; RoHS: TRUE; Temperature: -40°C to +150°C; ComponentLink2URL: https://www.st.com/content/ccc/resource/technical/document/datasheet/07/50/54/f2/0d/ba/4a/79/CD00001322.pdf/files/CD00001322.pdf/jcr:content/translations/en.CD00001322.pdf; Lead Free: Yes; Forward Current: 300mA; Package: SOD-523; Mouser Description: Schottky Diodes & Rectifiers schottky diode
R48-R50 = ERJ-8ENF2201V: RES SMD 2.2K OHM 1% 1/4W 1206; Manufacturer: Panasonic Electronic Components; Factory Stock: 0; Unit Price (USD): 0.00933; @ qty: 1500; Minimum Quantity: 1; Power (Watts): 0.25W, 1/4W; Temperature Coefficient: ±100ppm/°C; Part Number: ERJ-8ENF2201V; Datasheets: http://industrial.panasonic.com/www-cgi/jvcr13pz.cgi?E+PZ+3+AOA0002+ERJ8ENF2201V+7+WW; Image: //media.digikey.com/Renders/Panasonic%20Renders/ERJ-1206%20Pkg.jpg; Digi-Key Part Number: P2.20KFCT-ND; Quantity Available: 220817; Packaging: Cut Tape (CT); Series: ERJ; Part Status: Active; Value: 2.2k; Tolerance: ±1%; Composition: Thick Film; Features: Automotive AEC-Q200; Operating Temperature: -55°C ~ 155°C; Package / Case: 1206 (3216 Metric); Supplier Device Package: 1206; Size / Dimension: 0.126" L x 0.063" W (3.20mm x 1.60mm); Height - Seated (Max): 0.028" (0.70mm); Number of Terminations: 2; Failure Rate: -
R51-R53 = ERJ-6ENF1002V: RES SMD 10K OHM 1% 1/8W 0805; Manufacturer: Panasonic Electronic Components; Factory Stock: 0; Unit Price (USD): 0.00729; @ qty: 1500; Minimum Quantity: 1; Power (Watts): 0.125W, 1/8W; Temperature Coefficient: ±100ppm/°C; Part Number: ERJ-6ENF1002V; Datasheets: http://industrial.panasonic.com/www-cgi/jvcr13pz.cgi?E+PZ+3+AOA0002+ERJ6ENF1002V+7+WW; Image: //media.digikey.com/Renders/Panasonic%20Renders/ERJ-0805%20Pkg.jpg; Digi-Key Part Number: P10.0KCCT-ND; Quantity Available: 3985614; Packaging: Cut Tape (CT); Series: ERJ; Part Status: Active; Value: 10k; Tolerance: ±1%; Composition: Thick Film; Features: Automotive AEC-Q200; Operating Temperature: -55°C ~ 155°C; Package / Case: 0805 (2012 Metric); Supplier Device Package: 0805; Size / Dimension: 0.079" L x 0.049" W (2.00mm x 1.25mm); Height - Seated (Max): 0.028" (0.70mm); Number of Terminations: 2; Failure Rate: -
SB1-SB3 SB23-SB26 = Solder Bridge: Circuit Breaker; Published: 24-Mar-1999; Revision: July-2002: Re-released for DXP Platform.; Publisher: Altium Limited

## Sheet Current Sense.SchDoc
size C
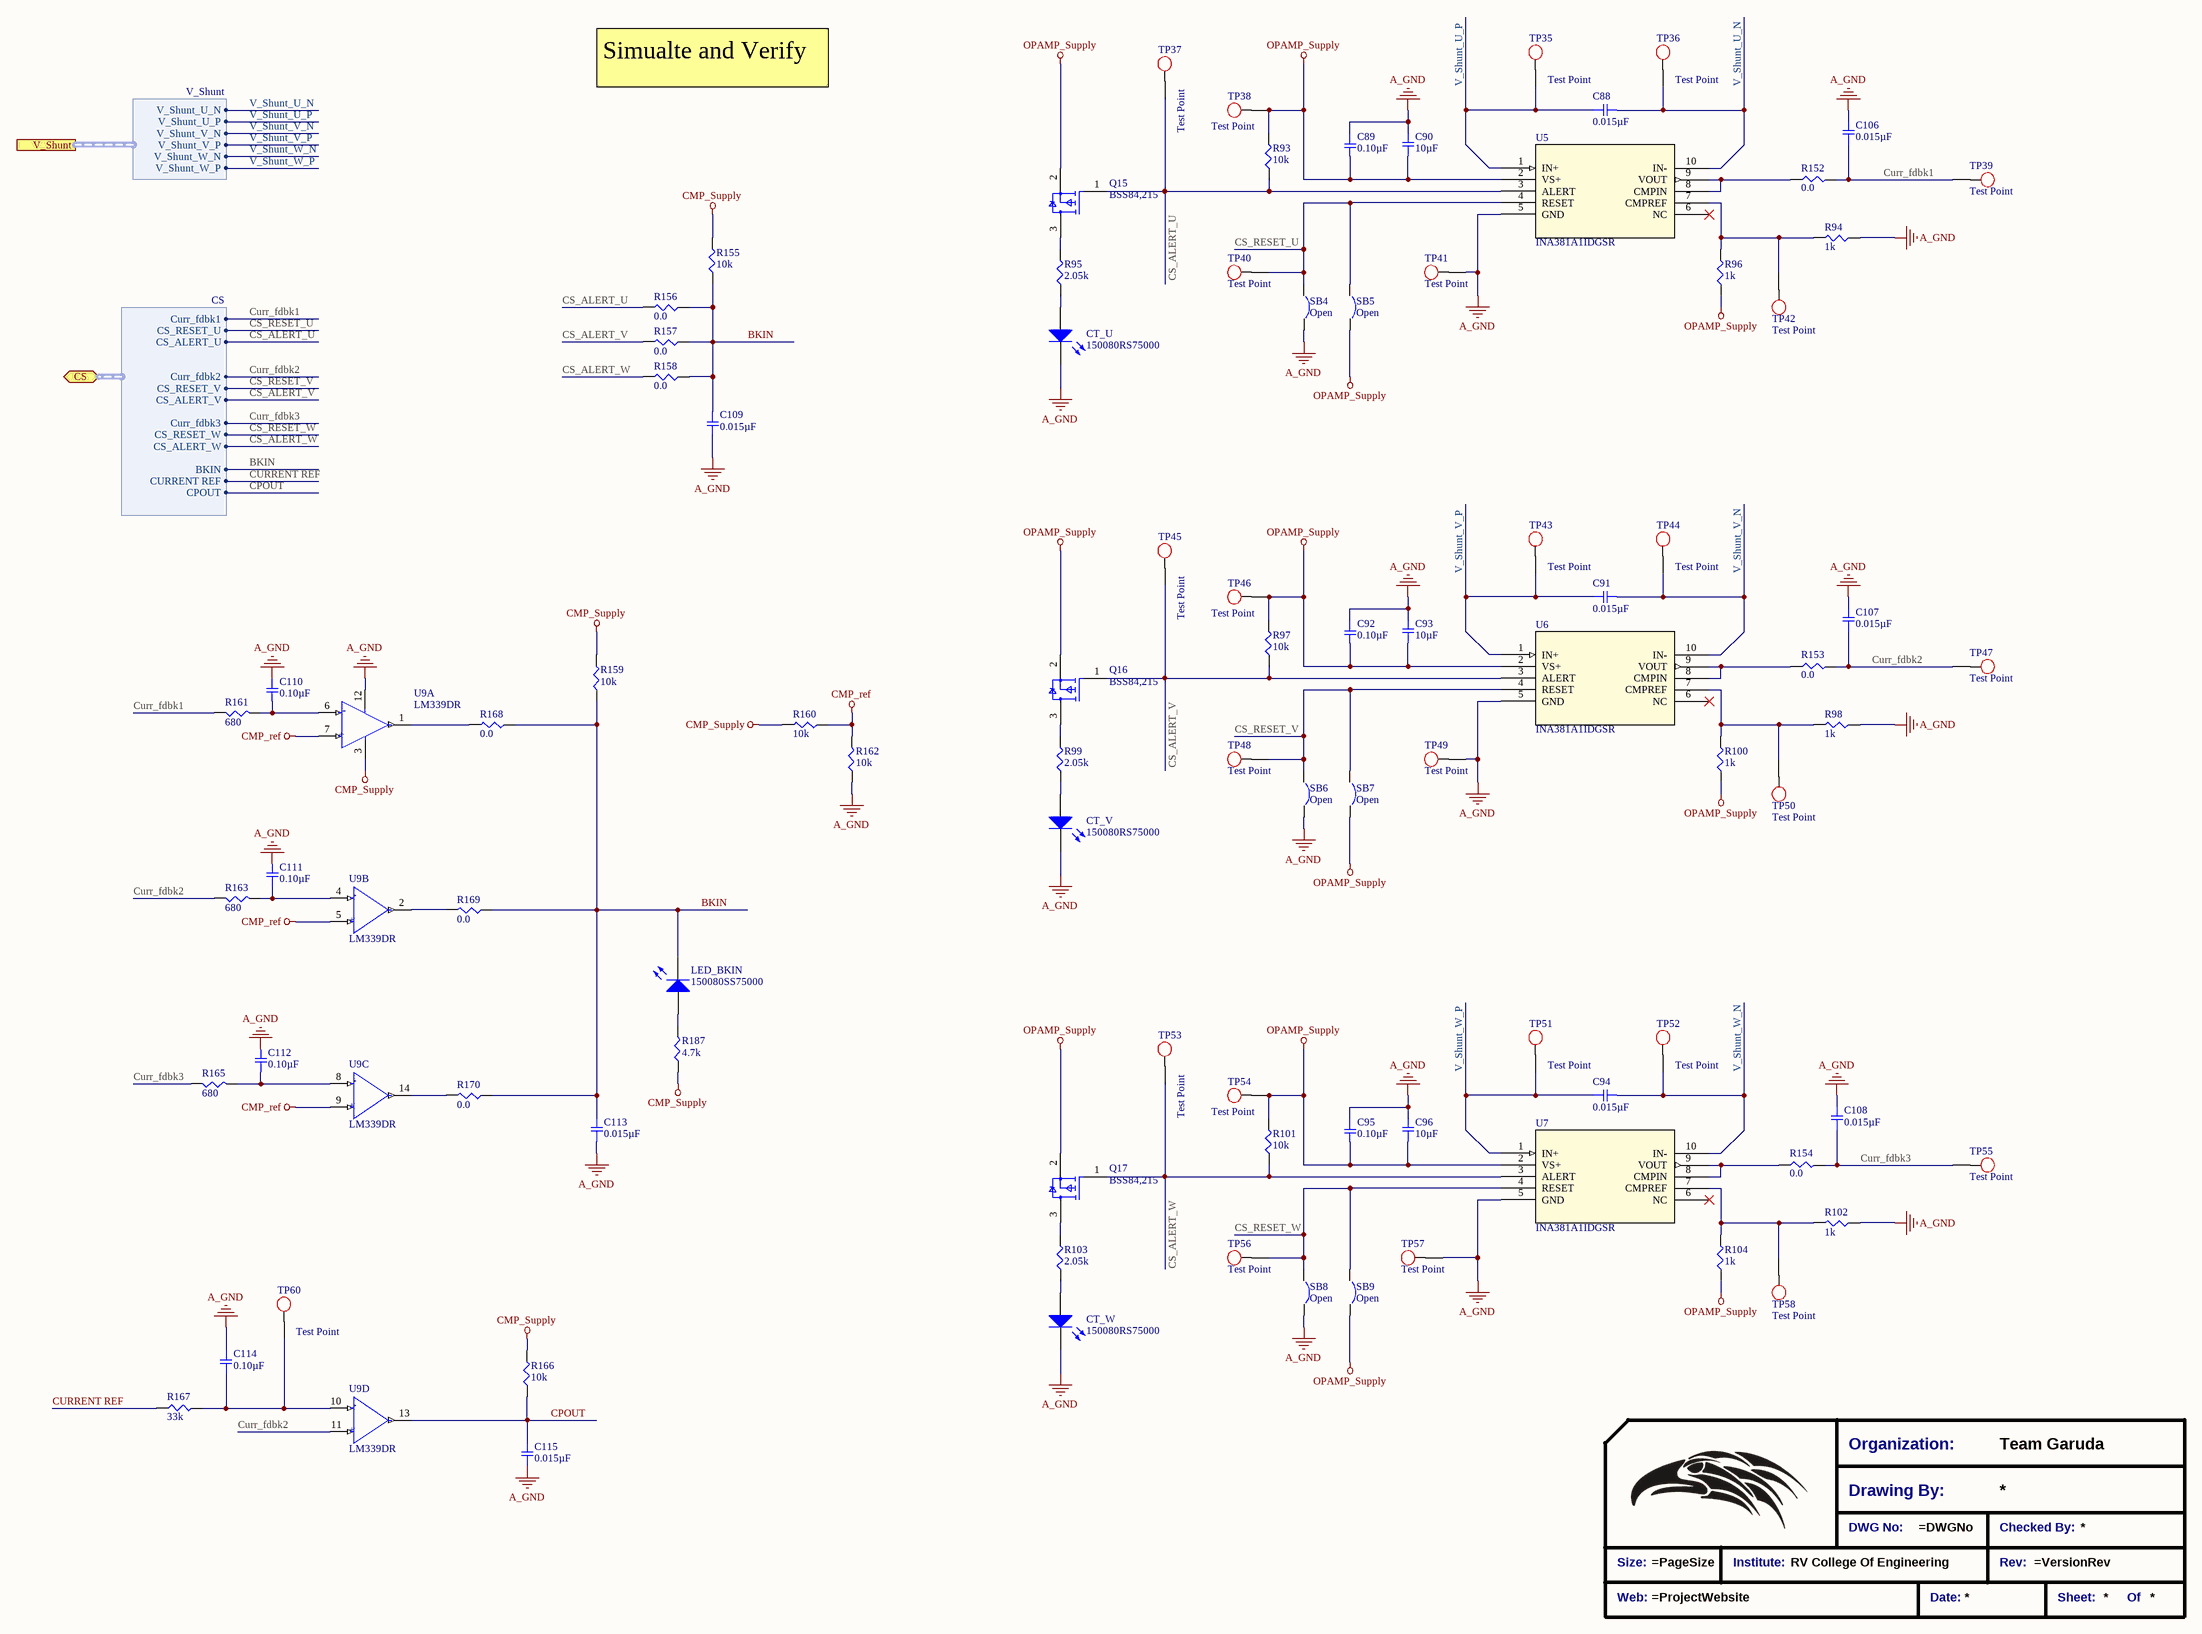
[diagram p8: Current Sense.SchDoc]

### Parts
(Parts that share a designator on the sheet are numbered #1, #2 ... from top to bottom, then left to right.)
*?#6  Title_Block  (value not drawn)  (graphical)
C88  0.015µF  [SMD-0603C]
C89  0.10µF  [SMD-0805C]
C90  10µF  [SMD-1206C]
C91  0.015µF  [SMD-0603C]
C92  0.10µF  [SMD-0805C]
C93  10µF  [SMD-1206C]
C94  0.015µF  [SMD-0603C]
C95  0.10µF  [SMD-0805C]
C96  10µF  [SMD-1206C]
C106  0.015µF  [SMD-0603C]
C107  0.015µF  [SMD-0603C]
C108  0.015µF  [SMD-0603C]
C109  0.015µF  [SMD-0603C]
C110  0.10µF  [SMD-0805C]
C111  0.10µF  [SMD-0805C]
C112  0.10µF  [SMD-0805C]
C113  0.015µF  [SMD-0603C]
C114  0.10µF  [SMD-0805C]
C115  0.015µF  [SMD-0603C]
CT_U  150080RS75000  [0805_A]
CT_V  150080RS75000  [0805_A]
CT_W  150080RS75000  [0805_A]
LED_BKIN  150080SS75000  [0805_A]
Q15  BSS84,215  [FP-SOT23-MFG]
Q16  BSS84,215  [FP-SOT23-MFG]
Q17  BSS84,215  [FP-SOT23-MFG]
R93  10k  [SMD-0603-RES]
R94  1k  [SMD-0603-RES]
R95  2.05k  [SMD-0603-RES]
R96  1k  [SMD-0603-RES]
R97  10k  [SMD-0603-RES]
R98  1k  [SMD-0603-RES]
R99  2.05k  [SMD-0603-RES]
R100  1k  [SMD-0603-RES]
R101  10k  [SMD-0603-RES]
R102  1k  [SMD-0603-RES]
R103  2.05k  [SMD-0603-RES]
R104  1k  [SMD-0603-RES]
R152  0.0  [SMD-0603-RES]
R153  0.0  [SMD-0603-RES]
R154  0.0  [SMD-0603-RES]
R155  10k  [SMD-0603-RES]
R156  0.0  [SMD-0603-RES]
R157  0.0  [SMD-0603-RES]
R158  0.0  [SMD-0603-RES]
R159  10k  [SMD-0603-RES]
R160  10k  [SMD-0603-RES]
R161  680  [SMD-0603-RES]
R162  10k  [SMD-0603-RES]
R163  680  [SMD-0603-RES]
R165  680  [SMD-0603-RES]
R166  10k  [SMD-0603-RES]
R167  33k  [SMD-0603-RES]
R168  0.0  [SMD-0603-RES]
R169  0.0  [SMD-0603-RES]
R170  0.0  [SMD-0603-RES]
R187  4.7k  [SMD-0805-RES]
SB4  Open  [SB_0603]  (no BOM)
SB5  Open  [SB_0603]  (no BOM)
SB6  Open  [SB_0603]  (no BOM)
SB7  Open  [SB_0603]  (no BOM)
SB8  Open  [SB_0603]  (no BOM)
SB9  Open  [SB_0603]  (no BOM)
TP35  Test Point  [Test_point_THT]  (no BOM)
TP36  Test Point  [Test_point_THT]  (no BOM)
TP37  Test Point  [Test_point_THT]  (no BOM)
TP38  Test Point  [Test_point_SMD]  (no BOM)
TP39  Test Point  [Test_point_THT]  (no BOM)
TP40  Test Point  [Test_point_SMD]  (no BOM)
TP41  Test Point  [Test_point_THT]  (no BOM)
TP42  Test Point  [Test_point_THT]  (no BOM)
TP43  Test Point  [Test_point_THT]  (no BOM)
TP44  Test Point  [Test_point_THT]  (no BOM)
TP45  Test Point  [Test_point_THT]  (no BOM)
TP46  Test Point  [Test_point_SMD]  (no BOM)
TP47  Test Point  [Test_point_THT]  (no BOM)
TP48  Test Point  [Test_point_SMD]  (no BOM)
TP49  Test Point  [Test_point_THT]  (no BOM)
TP50  Test Point  [Test_point_THT]  (no BOM)
TP51  Test Point  [Test_point_THT]  (no BOM)
TP52  Test Point  [Test_point_THT]  (no BOM)
TP53  Test Point  [Test_point_THT]  (no BOM)
TP54  Test Point  [Test_point_SMD]  (no BOM)
TP55  Test Point  [Test_point_THT]  (no BOM)
TP56  Test Point  [Test_point_SMD]  (no BOM)
TP57  Test Point  [Test_point_THT]  (no BOM)
TP58  Test Point  [Test_point_THT]  (no BOM)
TP60  Test Point  [Test_point_THT]  (no BOM)
U5  INA381A1IDGSR  [TSSOP50P490X110-10N]
U6  INA381A1IDGSR  [TSSOP50P490X110-10N]
U7  INA381A1IDGSR  [TSSOP50P490X110-10N]
U9  LM339DR  [FP-D0014A-MFG]  (parts A,B,C,D of 4)

### Ports
CS (bidir, harness CS), V_Shunt (harness V_Shunt)

### Harnesses
CS: Curr_fdbk1, CS_RESET_U, CS_ALERT_U, Curr_fdbk2, CS_RESET_V, CS_ALERT_V, Curr_fdbk3, CS_RESET_W, CS_ALERT_W, BKIN, CURRENT REF, CPOUT
V_Shunt: V_Shunt_U_N, V_Shunt_U_P, V_Shunt_V_N, V_Shunt_V_P, V_Shunt_W_N, V_Shunt_W_P

### Nets
A_GND: C89.1 C90.2 C92.1 C93.2 C95.1 C96.2 C106.2 C107.2 C108.2 C109.2 C110.1 C111.2 C112.2 C113.1 C114.2 C115.1 CT_U.1(K) CT_V.1(K) CT_W.1(K) R94.1 R98.1 R102.1 R162.1 SB4.1 SB6.1 SB8.1 TP41.1 TP49.1 TP57.1 U5.5(GND) U6.5(GND) U7.5(GND) U9.12(GND)
CMP_ref: R160.1 R162.2 U9.5(2IN+) U9.7(1IN+) U9.9(3IN+)
CMP_Supply: R155.2 R159.2 R160.2 R166.2 R187.1 U9.3(VCC)
OPAMP_Supply: C89.2 C90.1 C92.2 C93.1 C95.2 C96.1 Q15.2(S) Q16.2(S) Q17.2(S) R93.2 R96.1 R97.2 R100.1 R101.2 R104.1 SB5.1 SB7.1 SB9.1 TP38.1 TP46.1 TP54.1 U5.2(VS+) U6.2(VS+) U7.2(VS+)
BKIN: C109.1 C113.2 LED_BKIN.1(K) R155.1 R156.1 R157.1 R158.1 R159.1 R168.1 R169.1 R170.1 ; port CS.BKIN
CPOUT: C115.2 R166.1 U9.13(OUT4) ; port CS.CPOUT
CS_ALERT_U: Q15.1(G) R93.1 R156.2 TP37.1 U5.3(ALERT) ; port CS.CS_ALERT_U
CS_ALERT_V: Q16.1(G) R97.1 R157.2 TP45.1 U6.3(ALERT) ; port CS.CS_ALERT_V
CS_ALERT_W: Q17.1(G) R101.1 R158.2 TP53.1 U7.3(ALERT) ; port CS.CS_ALERT_W
CS_RESET_U: SB4.2 SB5.2 TP40.1 U5.4(RESET) ; port CS.CS_RESET_U
CS_RESET_V: SB6.2 SB7.2 TP48.1 U6.4(RESET) ; port CS.CS_RESET_V
CS_RESET_W: SB8.2 SB9.2 TP56.1 U7.4(RESET) ; port CS.CS_RESET_W
Curr_fdbk1: C106.1 R152.2 R161.1 TP39.1 ; port CS.Curr_fdbk1
Curr_fdbk2: C107.1 R153.2 R163.1 TP47.1 U9.11(4IN+) ; port CS.Curr_fdbk2
Curr_fdbk3: C108.1 R154.2 R165.1 TP55.1 ; port CS.Curr_fdbk3
CURRENT REF: R167.1 ; port CS.CURRENT REF
V_Shunt_U_N: C88.2 TP36.1 U5.10(IN-) ; port V_Shunt.V_Shunt_U_N
V_Shunt_U_P: C88.1 TP35.1 U5.1(IN+) ; port V_Shunt.V_Shunt_U_P
V_Shunt_V_N: C91.2 TP44.1 U6.10(IN-) ; port V_Shunt.V_Shunt_V_N
V_Shunt_V_P: C91.1 TP43.1 U6.1(IN+) ; port V_Shunt.V_Shunt_V_P
V_Shunt_W_N: C94.2 TP52.1 U7.10(IN-) ; port V_Shunt.V_Shunt_W_N
V_Shunt_W_P: C94.1 TP51.1 U7.1(IN+) ; port V_Shunt.V_Shunt_W_P
NetC110_2: C110.2 R161.2 U9.6(1IN-)
NetC111_1: C111.1 R163.2 U9.4(2IN-)
NetC112_1: C112.1 R165.2 U9.8(3IN-)
NetC114_1: C114.1 R167.2 TP60.1 U9.10(4IN-)
NetCT_U_2: CT_U.2(A) R95.1
NetCT_V_2: CT_V.2(A) R99.1
NetCT_W_2: CT_W.2(A) R103.1
NetLED_BKIN_2: LED_BKIN.2(A) R187.2
NetQ15_3: Q15.3(D) R95.2
NetQ16_3: Q16.3(D) R99.2
NetQ17_3: Q17.3(D) R103.2
NetR94_2: R94.2 R96.2 TP42.1 U5.7(CMPREF)
NetR98_2: R98.2 R100.2 TP50.1 U6.7(CMPREF)
NetR102_2: R102.2 R104.2 TP58.1 U7.7(CMPREF)
NetR152_1: R152.1 U5.8(CMPIN) U5.9(VOUT)
NetR153_1: R153.1 U6.8(CMPIN) U6.9(VOUT)
NetR154_1: R154.1 U7.8(CMPIN) U7.9(VOUT)
NetR168_2: R168.2 U9.1(1OUT)
NetR169_2: R169.2 U9.2(2OUT)
NetR170_2: R170.2 U9.14(OUT3)

Not connected (* = marked no-connect by the designer): U5 6(NC)*; U6 6(NC)*; U7 6(NC)*

### Notes on the sheet
- Simualte and Verify
- (in symbol CMP-04896-000028-1, part A) -; +
- (in symbol CMP-04896-000028-1, part B) -; +
- (in symbol CMP-04896-000028-1, part C) -; +
- (in symbol CMP-04896-000028-1, part D) -; +
- (in symbol Title_Block) Organization:; Team Garuda; Drawing By:; DWG No:; Checked By:; Size:; Institute:; RV College Of Engineering; Rev:; Web:; Date:; Sheet:; Of

### Library data of the parts
*?#6 = Title_Block: Standard Title Block
C88 C91 C94 C106-C109 C113 C115 = GCJ188R72A153KA01D: CAP CER 0.015UF 100V X7R 0603; Manufacturer: Murata Electronics North America; Factory Stock: 0; Unit Price (USD): 0.26; Minimum Quantity: 1; Tolerance: ±10%; Datasheets: http://www.murata.com/~/media/webrenewal/support/library/catalog/products/capacitor/mlcc/c03e.ashx; Image: //media.digikey.com/Renders/Murata%20Renders/0603%28LQG18%29.jpg; Digi-Key Part Number: 490-5770-1-ND; Part Number: GCJ188R72A153KA01D; Quantity Available: 450; @ qty: 0; Packaging: Cut Tape (CT); Series: GCJ; Part Status: Active; Value: 0.015µF; Voltage: 100V; Temperature Coefficient: X7R; Operating Temperature: -55°C ~ 125°C; Features: Soft Termination; Ratings: AEC-Q200; Applications: Automotive, Boardflex Sensitive; Mounting Type: Surface Mount, MLCC; Package / Case: 0603 (1608 Metric); Size / Dimension: 0.063" L x 0.031" W (1.60mm x 0.80mm); Height - Seated (Max): -; Thickness (Max): 0.031" (0.80mm); Lead Spacing: -; Lead Style: -
C89 C92 C95 C110-C112 C114 = GCM21BR71H104KA37K: CAP CER 0.1UF 50V X7R 0805; Manufacturer: Murata Electronics North America; Factory Stock: 0; Unit Price (USD): 0.12; Minimum Quantity: 1; Tolerance: ±10%; Datasheets: http://www.murata.com/~/media/webrenewal/support/library/catalog/products/capacitor/mlcc/c03e.ashx; Image: //media.digikey.com/photos/Murata%20Photos/NCP,GCM%20SERIES%200805.jpg; Digi-Key Part Number: 490-8049-1-ND; Part Number: GCM21BR71H104KA37K; Quantity Available: 322; @ qty: 0; Packaging: Cut Tape (CT); Series: GCM; Part Status: Active; Value: 0.10µF; Voltage: 50V; Temperature Coefficient: X7R; Operating Temperature: -55°C ~ 125°C; Features: -; Ratings: AEC-Q200; Applications: Automotive; Mounting Type: Surface Mount, MLCC; Package / Case: 0805 (2012 Metric); Size / Dimension: 0.079" L x 0.049" W (2.00mm x 1.25mm); Height - Seated (Max): -; Thickness (Max): 0.055" (1.40mm); Lead Spacing: -; Lead Style: -
C90 C93 C96 = GRJ31CR71E106KE11L: CAP CER 10UF 25V X7R 1206; Manufacturer: Murata Electronics North America; Factory Stock: 0; Unit Price (USD): 0.69; Minimum Quantity: 1; Tolerance: ±10%; Datasheets: http://www.murata.com/~/media/webrenewal/support/library/catalog/products/capacitor/mlcc/c02e.pdf; Image: //media.digikey.com/Renders/Murata%20Renders/GR331BD72E473KW01L.jpg; Digi-Key Part Number: 490-10940-1-ND; Part Number: GRJ31CR71E106KE11L; Quantity Available: 1598; @ qty: 0; Packaging: Cut Tape (CT); Series: GRJ; Part Status: Active; Value: 10µF; Voltage: 25V; Temperature Coefficient: X7R; Operating Temperature: -55°C ~ 125°C; Features: Soft Termination; Ratings: -; Applications: Boardflex Sensitive; Mounting Type: Surface Mount, MLCC; Package / Case: 1206 (3216 Metric); Size / Dimension: 0.126" L x 0.063" W (3.20mm x 1.60mm); Height - Seated (Max): -; Thickness (Max): 0.075" (1.90mm); Lead Spacing: -; Lead Style: -
CT_U CT_V CT_W = 150080RS75000: SMD mono-color Chip LED, WL-SMCW, Red; PackageReference: 0805_A; Color: Red; PartNumber: 150080RS75000; ComponentLink1Description: Manufacturer URL; ComponentLink1URL: http://www.we-online.com; ComponentLink2Description: Datasheet; ComponentLink2URL: http://katalog.we-online.com/led/datasheet/150080RS75000.pdf
LED_BKIN = 150080SS75000: SMD mono-color Chip LED, WL-SMCW, Super Red; PackageReference: 0805_A; Color: Super Red; PartNumber: 150080SS75000; ComponentLink1Description: Manufacturer URL; ComponentLink1URL: http://www.we-online.com; ComponentLink2Description: Datasheet; ComponentLink2URL: http://katalog.we-online.com/led/datasheet/150080SS75000.pdf
Q15-Q17 = CMP-14409-000006-1: MOSFET P-CH 50V 130MA SOT-23; Manufacturer: Nexperia USA Inc.; Drain To Source Breakdown Voltage: -50V; Max Junction Temp: +150°C; Threshold Vgs Min: -0.8V; Turn On Delay Time: 3ns; Power Dissipation: 250mW; Turn Off Delay Time: 7ns; Gate To Source Voltage: 20V; Number Of Channels: 1; Input Capacitace At Vds: 25pF @ -25V; Threshold Vgs Max: -2V; Continuous Drain Current: -130mA; Depletion Mode: False; Drain To Source Resistance: 6Ω; Rthja Max: 500K/W; Octopart: https://octopart.com/bss84%2C215-nexperia-78739375; Ipc Land Pattern Name: SOT95P230X100-3; Drain To Source Voltage: -50V; Lead Free: Yes; Temperature Range High: +150°C; Automotive: No; Device Class L2: Transistors; Manufacturer Part Number: BSS84,215; Package: SOT23; ComponentLink2URL: https://assets.nexperia.com/documents/data-sheet/BSS84.pdf; Category: Trans; RoHS: TRUE; Temperature Range Low: -65°C; ComponentLink2Description: Datasheet; Device Class L1: Discrete Semiconductors; Number Of P Channels: 1; Device Class L3: MOSFETs; Height: 1.1mm; Digikey Description: MOSFET P-CH 50V 130MA SOT-23; Temperature: -65°C to +150°C; Footprint Url: https://assets.nexperia.com/documents/outline-drawing/SOT23.pdf
R93 R97 R101 R155 R159 R160 R162 R166 = ERJ-3EKF1002V: RES SMD 10K OHM 1% 1/10W 0603; Manufacturer: Panasonic Electronic Components; Factory Stock: 0; Unit Price (USD): 0.00379; @ qty: 1500; Minimum Quantity: 1; Power (Watts): 0.1W, 1/10W; Temperature Coefficient: ±100ppm/°C; Part Number: ERJ-3EKF1002V; Datasheets: http://industrial.panasonic.com/www-cgi/jvcr13pz.cgi?E+PZ+3+AOA0002+ERJ3EKF1002V+7+WW; Image: //media.digikey.com/Photos/Panasonic%20Photos/MFG_ERJ-P6W%20Series.jpg; Digi-Key Part Number: P10.0KHCT-ND; Quantity Available: 6703141; Packaging: Cut Tape (CT); Series: ERJ; Part Status: Active; Value: 10k; Tolerance: ±1%; Composition: Thick Film; Features: Automotive AEC-Q200; Operating Temperature: -55°C ~ 155°C; Package / Case: 0603 (1608 Metric); Supplier Device Package: 0603; Size / Dimension: 0.063" L x 0.031" W (1.60mm x 0.80mm); Height - Seated (Max): 0.022" (0.55mm); Number of Terminations: 2; Failure Rate: -
R94 R96 R98 R100 R102 R104 = ERJ-3EKF1001V: RES SMD 1K OHM 1% 1/10W 0603; Manufacturer: Panasonic Electronic Components; Factory Stock: 0; Unit Price (USD): 0.00379; @ qty: 1500; Minimum Quantity: 1; Power (Watts): 0.1W, 1/10W; Temperature Coefficient: ±100ppm/°C; Part Number: ERJ-3EKF1001V; Datasheets: http://industrial.panasonic.com/www-cgi/jvcr13pz.cgi?E+PZ+3+AOA0002+ERJ3EKF1001V+7+WW; Image: //media.digikey.com/Photos/Panasonic%20Photos/MFG_ERJ-P6W%20Series.jpg; Digi-Key Part Number: P1.00KHCT-ND; Quantity Available: 5218845; Packaging: Cut Tape (CT); Series: ERJ; Part Status: Active; Value: 1k; Tolerance: ±1%; Composition: Thick Film; Features: Automotive AEC-Q200; Operating Temperature: -55°C ~ 155°C; Package / Case: 0603 (1608 Metric); Supplier Device Package: 0603; Size / Dimension: 0.063" L x 0.031" W (1.60mm x 0.80mm); Height - Seated (Max): 0.022" (0.55mm); Number of Terminations: 2; Failure Rate: -
R95 R99 R103 = ERJ-3EKF2051V: RES SMD 2.05K OHM 1% 1/10W 0603; Manufacturer: Panasonic Electronic Components; Factory Stock: 0; Unit Price (USD): 0.00379; @ qty: 1500; Minimum Quantity: 1; Power (Watts): 0.1W, 1/10W; Temperature Coefficient: ±100ppm/°C; Part Number: ERJ-3EKF2051V; Datasheets: http://industrial.panasonic.com/www-cgi/jvcr13pz.cgi?E+PZ+3+AOA0002+ERJ3EKF2051V+7+WW; Image: //media.digikey.com/Photos/Panasonic%20Photos/MFG_ERJ-P6W%20Series.jpg; Digi-Key Part Number: P2.05KHCT-ND; Quantity Available: 48175; Packaging: Cut Tape (CT); Series: ERJ; Part Status: Active; Value: 2.05k; Tolerance: ±1%; Composition: Thick Film; Features: Automotive AEC-Q200; Operating Temperature: -55°C ~ 155°C; Package / Case: 0603 (1608 Metric); Supplier Device Package: 0603; Size / Dimension: 0.063" L x 0.031" W (1.60mm x 0.80mm); Height - Seated (Max): 0.022" (0.55mm); Number of Terminations: 2; Failure Rate: -
R152-R154 R156-R158 R168-R170 = ERJ-3GEY0R00V: RES SMD 0.0OHM JUMPER 1/10W 0603; Manufacturer: Panasonic Electronic Components; Factory Stock: 0; Unit Price (USD): 0.00352; @ qty: 1500; Minimum Quantity: 1; Power (Watts): 0.1W, 1/10W; Part Number: ERJ-3GEY0R00V; Datasheets: http://industrial.panasonic.com/www-cgi/jvcr13pz.cgi?E+PZ+3+AOA0001+ERJ3GEY0R00V+7+WW; Image: //media.digikey.com/Photos/Panasonic%20Photos/MFG_ERJ-P6W%20Series.jpg; Digi-Key Part Number: P0.0GCT-ND; Quantity Available: 4813372; Packaging: Cut Tape (CT); Series: ERJ; Part Status: Active; Value: 0.0; Tolerance: Jumper; Composition: Thick Film; Features: Automotive AEC-Q200; Temperature Coefficient: -; Operating Temperature: -55°C ~ 155°C; Package / Case: 0603 (1608 Metric); Supplier Device Package: 0603; Size / Dimension: 0.063" L x 0.031" W (1.60mm x 0.80mm); Height - Seated (Max): 0.022" (0.55mm); Number of Terminations: 2; Failure Rate: -
R161 R163 R165 = ERJ-3EKF6800V: RES SMD 680 OHM 1% 1/10W 0603; Manufacturer: Panasonic Electronic Components; Factory Stock: 0; Unit Price (USD): 0.00379; @ qty: 1500; Minimum Quantity: 1; Power (Watts): 0.1W, 1/10W; Temperature Coefficient: ±100ppm/°C; Part Number: ERJ-3EKF6800V; Datasheets: http://industrial.panasonic.com/www-cgi/jvcr13pz.cgi?E+PZ+3+AOA0002+ERJ3EKF6800V+7+WW; Image: //media.digikey.com/Photos/Panasonic%20Photos/MFG_ERJ-P6W%20Series.jpg; Digi-Key Part Number: P680HCT-ND; Quantity Available: 89165; Packaging: Cut Tape (CT); Series: ERJ; Part Status: Active; Value: 680; Tolerance: ±1%; Composition: Thick Film; Features: Automotive AEC-Q200; Operating Temperature: -55°C ~ 155°C; Package / Case: 0603 (1608 Metric); Supplier Device Package: 0603; Size / Dimension: 0.063" L x 0.031" W (1.60mm x 0.80mm); Height - Seated (Max): 0.022" (0.55mm); Number of Terminations: 2; Failure Rate: -
R167 = ERJ-PA3F3302V: RES SMD 33K OHM 1% 1/4W 0603; Manufacturer: Panasonic Electronic Components; Factory Stock: 0; Unit Price (USD): 0.02372; @ qty: 1500; Minimum Quantity: 1; Power (Watts): 0.25W, 1/4W; Temperature Coefficient: ±100ppm/°C; Part Number: ERJ-PA3F3302V; Datasheets: https://industrial.panasonic.com/cdbs/www-data/pdf/RDA0000/AOA0000C243.pdf; Image: //media.digikey.com/Photos/Panasonic%20Photos/MFG_ERJ-P6W%20Series.jpg; Digi-Key Part Number: P33KBYCT-ND; Quantity Available: 3504; Packaging: Cut Tape (CT); Series: ERJ; Part Status: Active; Value: 33k; Tolerance: ±1%; Composition: Thick Film; Features: Automotive AEC-Q200, Pulse Withstanding; Operating Temperature: -55°C ~ 155°C; Package / Case: 0603 (1608 Metric); Supplier Device Package: 0603; Size / Dimension: 0.063" L x 0.031" W (1.60mm x 0.80mm); Height - Seated (Max): 0.022" (0.55mm); Number of Terminations: 2; Failure Rate: -
R187 = ERJ-6ENF4701V: RES SMD 4.7K OHM 1% 1/8W 0805; Manufacturer: Panasonic Electronic Components; Factory Stock: 0; Unit Price (USD): 0.00729; @ qty: 1500; Minimum Quantity: 1; Power (Watts): 0.125W, 1/8W; Temperature Coefficient: ±100ppm/°C; Part Number: ERJ-6ENF4701V; Datasheets: http://industrial.panasonic.com/www-cgi/jvcr13pz.cgi?E+PZ+3+AOA0002+ERJ6ENF4701V+7+WW; Image: //media.digikey.com/Renders/Panasonic%20Renders/ERJ-0805%20Pkg.jpg; Digi-Key Part Number: P4.70KCCT-ND; Quantity Available: 312387; Packaging: Cut Tape (CT); Series: ERJ; Part Status: Active; Value: 4.7k; Tolerance: ±1%; Composition: Thick Film; Features: Automotive AEC-Q200; Operating Temperature: -55°C ~ 155°C; Package / Case: 0805 (2012 Metric); Supplier Device Package: 0805; Size / Dimension: 0.079" L x 0.049" W (2.00mm x 1.25mm); Height - Seated (Max): 0.028" (0.70mm); Number of Terminations: 2; Failure Rate: -
SB4-SB9 = Solder Bridge: Circuit Breaker; Published: 24-Mar-1999; Revision: July-2002: Re-released for DXP Platform.; Publisher: Altium Limited
U5-U7 = INA381A1IDGSR: No Description Available; SourceLibrary: Texas_Instruments_2020-07-20; Built_By: EMA_Matt; Vendor: Texas Instruments; Datasheet: https://www.ti.com/lit/ds/symlink/ina381.pdf?ts=1595282869145&ref_url=https%253A%252F%252Fwww.ti.com%252Fstore%252Fti%252Fen%252Fp%252Fproduct%252F%253Fp%253DINA381A1IDGSR; Copyright: Copyright (C) 2018 Accelerated Designs. All rights reserved; Manufacturer_Part_Number: INA381A1IDGSR; RefDes: RefDes; Type: DEV
U9 = CMP-04896-000028-1: IC QUAD DIFF COMP 14-SOIC; Manufacturer: Texas Instruments; Nominal Supply Current: 0.8mA; Min Dual Supply Voltage: 1V; Number Of Channels: 4; Input Offset Voltage: 2mV; Max Junction Temp: +70°C; Min Supply Voltage: 2V; Response Time: 1.3us; Max Dual Supply Voltage: 18V; Max Supply Voltage: 30V; Standoff Height: 0.1mm; Input Bias Current: -0.025uA; Output Current Per Channel: 6mA; Category: IC; Octopart: https://octopart.com/lm339dr-texas+instruments-45532; Automotive: No; Temperature: 0°C to +70°C; Ipc Land Pattern Name: SOIC127P600X175-14; Temperature Range Low: 0°C; Mouser Description: Analog Comparators Quad Differential; Lead Free: Yes; Digikey Description: IC QUAD DIFF COMP 14-SOIC; ComponentLink2URL: http://www.ti.com/lit/ds/symlink/lm339.pdf; Device Class L3: Comparators; Manufacturer Part Number: LM339DR; Temperature Range High: +70°C; Device Class L2: Linear ICs; Height: 1.75mm; Device Class L1: Integrated Circuits (ICs); Package: D0014A; RoHS: TRUE; ComponentLink2Description: Datasheet